# Altium project sign_controller.PrjPcb
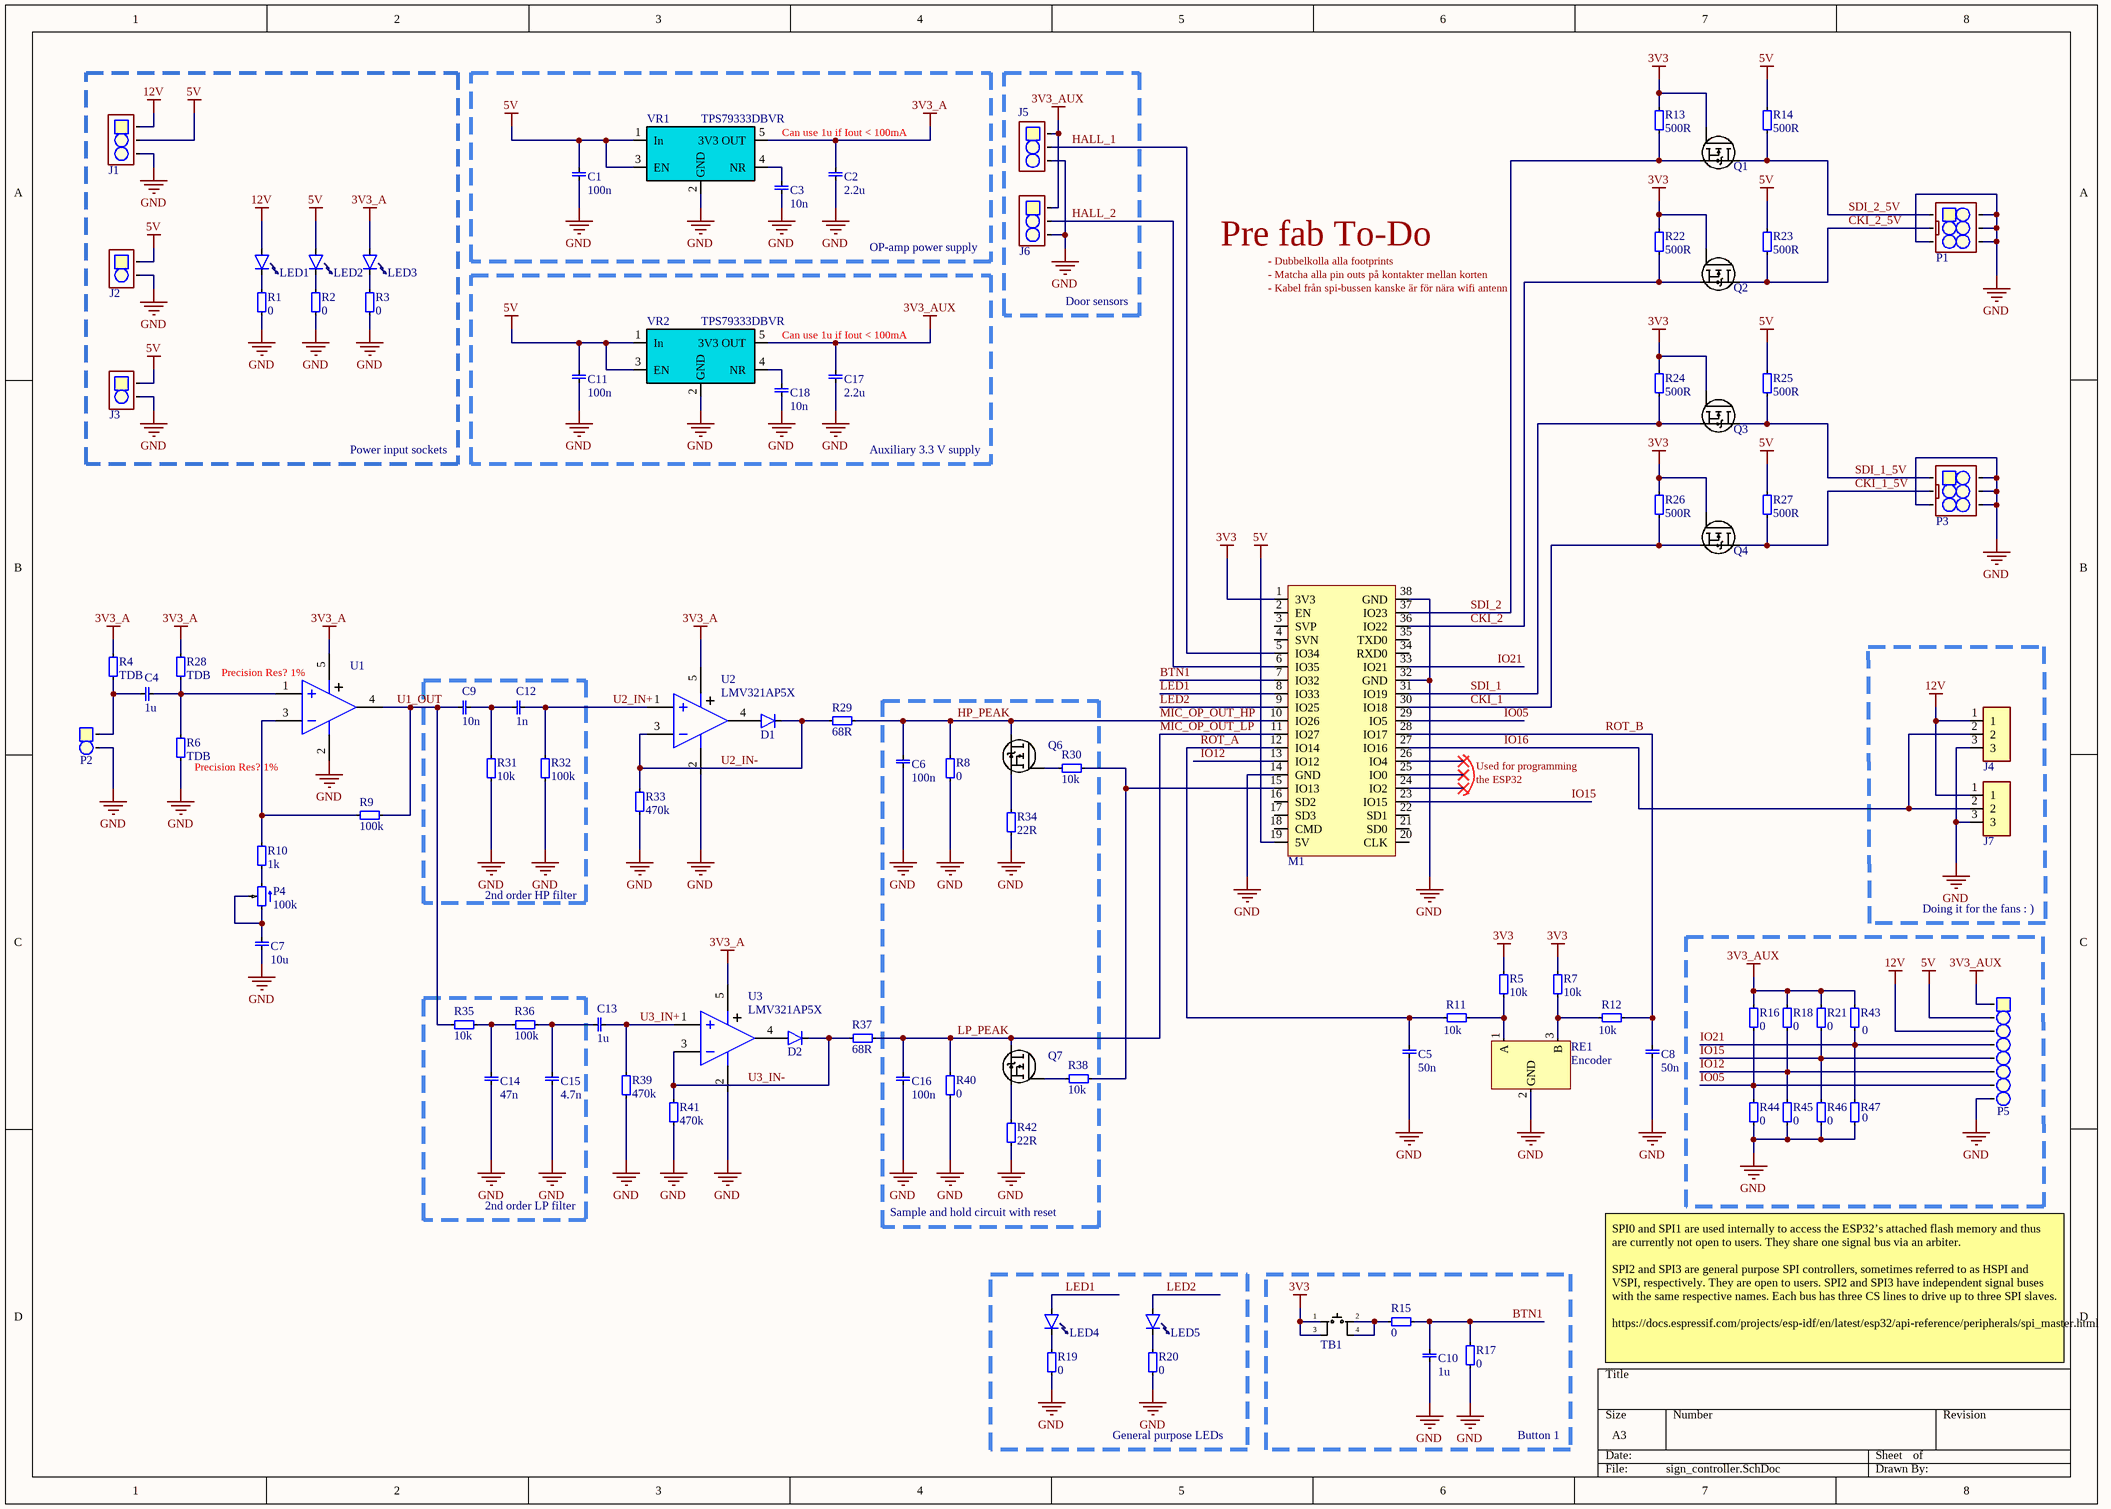
[diagram p0: sign_controller.SchDoc]
1 sheet, 98 parts. Net scope: global (net labels, ports and power ports of the same name join across sheets).
Board file: sign_controller.PcbDoc

## Sheet sign_controller.SchDoc
size A3; SheetNumber: 1; SheetTotal: 1

### Parts
C1  value 100n  [0603 cap]  (hidden comment: 0603, capacitor)
C2  value 2.2u  [1206, capasitor]  (hidden comment: 1206, capacitor)
C3  value 10n  [0603 cap]  (hidden comment: 0603, capacitor)
C4  value 1u  [1206, capasitor]  (hidden comment: 1206, capacitor)
C5  value 50n  [0603 cap]  (hidden comment: 0603, capacitor)
C6  value 100n  [0603 cap]  (hidden comment: 0603, capacitor)
C7  value 10u  [1206, capasitor]  (hidden comment: 1206, capacitor)
C8  value 50n  [0603 cap]  (hidden comment: 0603, capacitor)
C9  value 10n  [0603 cap]  (hidden comment: 0603, capacitor)
C10  value 1u  [0603 cap]  (hidden comment: 0603, capacitor)
C11  value 100n  [0603 cap]  (hidden comment: 0603, capacitor)
C12  value 1n  [0603 cap]  (hidden comment: 0603, capacitor)
C13  value 1u  [0603 cap]  (hidden comment: 0603, capacitor)
C14  value 47n  [0603 cap]  (hidden comment: 0603, capacitor)
C15  value 4.7n  [0603 cap]  (hidden comment: 0603, capacitor)
C16  value 100n  [0603 cap]  (hidden comment: 0603, capacitor)
C17  value 2.2u  [1206, capasitor]  (hidden comment: 1206, capacitor)
C18  value 10n  [0603 cap]  (hidden comment: 0603, capacitor)
D1  BAT18  [SOT23]  (value not drawn)
D2  BAT18  [SOT23]  (value not drawn)
J1  3 Pole MSTBA Connector  [3POLE_MSTBA_ANGLE]  (value not drawn)
J2  2 Pole MSTBA Connector  [2POLE_MSTBA_ANGLE]  (value not drawn)
J3  2 Pole MSTBA Connector  [2POLE_MSTBA_ANGLE]  (value not drawn)
J4  PicoBlade, 3 pos  [MOLEX_0530470310]  (value not drawn)
J5  3 Pole MSTBA Connector  [3POLE_MSTBA_ANGLE]  (value not drawn)
J6  3 Pole MSTBA Connector  [3POLE_MSTBA_ANGLE]  (value not drawn)
J7  PicoBlade, 3 pos  [MOLEX_0530470310]  (value not drawn)
LED1  0805, LED  [0805_led]  (value not drawn)
LED2  0805, LED  [0805_led]  (value not drawn)
LED3  0805, LED  [0805_led]  (value not drawn)
LED4  0805, LED  [0805_led]  (value not drawn)
LED5  0805, LED  [0805_led]  (value not drawn)
M1  ESP32-DEVKITC-32D-F  [ESP32_DEVKITC]  (value not drawn)
P1  2x3 Pin Header  [2x3 PH]  (value not drawn)
P2  1x2 Pin Header  [padtwo_L]  (value not drawn)
P3  2x3 Pin Header  [2x3 PH]  (value not drawn)
P4  value 100k  [POT_TH1]  (hidden comment: Pot)
P5  1x8 Pin Header  [1x8 Pin HEader]  (value not drawn)
Q1  BSS138  [SOT323]  (value not drawn)
Q2  BSS138  [SOT323]  (value not drawn)
Q3  BSS138  [SOT323]  (value not drawn)
Q4  BSS138  [SOT323]  (value not drawn)
Q6  BSS138  [SOT323]  (value not drawn)
Q7  BSS138  [SOT323]  (value not drawn)
R1  value 0  [0603]  (hidden comment: 0603, resistor)
R2  value 0  [0603]  (hidden comment: 0603, resistor)
R3  value 0  [0603]  (hidden comment: 0603, resistor)
R4  value TDB  [0603]  (hidden comment: 0603, resistor)
R5  value 10k  [0603]  (hidden comment: 0603, resistor)
R6  value TDB  [0603]  (hidden comment: 0603, resistor)
R7  value 10k  [0603]  (hidden comment: 0603, resistor)
R8  value 0  [0603]  (hidden comment: 0603, resistor)
R9  value 100k  [0603]  (hidden comment: 0603, resistor)
R10  value 1k  [0603]  (hidden comment: 0603, resistor)
R11  value 10k  [0603]  (hidden comment: 0603, resistor)
R12  value 10k  [0603]  (hidden comment: 0603, resistor)
R13  value 500R  [0603]  (hidden comment: 0603, resistor)
R14  value 500R  [0603]  (hidden comment: 0603, resistor)
R15  value 0  [0603]  (hidden comment: 0603, resistor)
R16  value 0  [0603]  (hidden comment: 0603, resistor)
R17  value 0  [0603]  (hidden comment: 0603, resistor)
R18  value 0  [0603]  (hidden comment: 0603, resistor)
R19  value 0  [0603]  (hidden comment: 0603, resistor)
R20  value 0  [0603]  (hidden comment: 0603, resistor)
R21  value 0  [0603]  (hidden comment: 0603, resistor)
R22  value 500R  [0603]  (hidden comment: 0603, resistor)
R23  value 500R  [0603]  (hidden comment: 0603, resistor)
R24  value 500R  [0603]  (hidden comment: 0603, resistor)
R25  value 500R  [0603]  (hidden comment: 0603, resistor)
R26  value 500R  [0603]  (hidden comment: 0603, resistor)
R27  value 500R  [0603]  (hidden comment: 0603, resistor)
R28  value TDB  [0603]  (hidden comment: 0603, resistor)
R29  value 68R  [0603]  (hidden comment: 0603, resistor)
R30  value 10k  [0603]  (hidden comment: 0603, resistor)
R31  value 10k  [0603]  (hidden comment: 0603, resistor)
R32  value 100k  [0603]  (hidden comment: 0603, resistor)
R33  value 470k  [0603]  (hidden comment: 0603, resistor)
R34  value 22R  [0603]  (hidden comment: 0603, resistor)
R35  value 10k  [0603]  (hidden comment: 0603, resistor)
R36  value 100k  [0603]  (hidden comment: 0603, resistor)
R37  value 68R  [0603]  (hidden comment: 0603, resistor)
R38  value 10k  [0603]  (hidden comment: 0603, resistor)
R39  value 470k  [0603]  (hidden comment: 0603, resistor)
R40  value 0  [0603]  (hidden comment: 0603, resistor)
R41  value 470k  [0603]  (hidden comment: 0603, resistor)
R42  value 22R  [0603]  (hidden comment: 0603, resistor)
R43  value 0  [0603]  (hidden comment: 0603, resistor)
R44  value 0  [0603]  (hidden comment: 0603, resistor)
R45  value 0  [0603]  (hidden comment: 0603, resistor)
R46  value 0  [0603]  (hidden comment: 0603, resistor)
R47  value 0  [0603]  (hidden comment: 0603, resistor)
RE1  Encoder  [RotaryEncoder]
TB1  Tactile Button  [tacButton smd]  (value not drawn)
U1  LMV321AP5X  [SOT23-5]  (value not drawn)
U2  LMV321AP5X  [SOT23-5]
U3  LMV321AP5X  [SOT23-5]
VR1  TPS79333DBVR  [SOT23-5]
VR2  TPS79333DBVR  [SOT23-5]

### Blocks framed on the sheet
Power input sockets: J1-J3 LED1-LED3 R1-R3
OP-amp power supply: C1-C3 VR1
Door sensors: J5 J6
Auxiliary 3.3 V supply: C11 C17 C18 VR2
Doing it for the fans : ): J4 J7
2nd order HP filter: C9 C12 R31 R32
Sample and hold circuit with reset: C6 C16 Q6 Q7 R8 R30 R34 R38 R40 R42
2nd order LP filter: C14 C15 R35 R36
Button 1: C10 R15 R17 TB1

### Nets
3V3: M1.1(3V3) Q1.1(G) Q2.1(G) Q3.1(G) Q4.1(G) R5.1 R7.1 R13.1 R22.1 R24.1 R26.1 TB1.1 TB1.3
3V3_A: C2.1 LED3.1 R4.0 R28.1 U1.5(V+) U2.5(V+) U3.5(V+) VR1.5(3V3_OUT)
3V3_AUX: C17.1 J5.1 J6.1 P5.1 R16.0 R18.0 R21.0 R43.0 VR2.5(3V3_OUT)
5V: C1.1 C11.1 J1.2 J2.1 J3.1 LED2.1 M1.19(5V) P5.2 R14.1 R23.1 R25.1 R27.1 VR1.1(In) VR1.3(EN) VR2.1(In) VR2.3(EN)
12V: J1.1 J4.1 J7.1 LED1.1 P5.3
GND: C1.0 C2.0 C3.0 C5.0 C6.0 C7.0 C8.0 C10.0 C11.0 C14.1 C15.1 C16.0 C17.0 C18.0 J1.3 J2.2 J3.2 J4.3 J5.3 J6.3 J7.3 M1.14(GND) M1.32(GND) M1.38(GND) P1.3 P1.4 P1.5 P1.6 P2.2 P3.3 P3.4 P3.5 P3.6 P5.8 R1.1 R2.1 R3.1 R6.1 R8.1 R17.1 R19.1 R20.1 R31.1 R32.1 R33.1 R34.1 R39.1 R40.1 R41.1 R42.1 R44.1 R45.1 R46.1 R47.1 RE1.2(GND) U1.2(V-) U2.2(V-) U3.2(V-) VR1.2(GND) VR2.2(GND)
BTN1: C10.1 M1.7(IO32) R15.0 R17.0
CKI_1: M1.30(IO18) Q4.2(S) R26.0
CKI_1_5V: P3.2 Q4.3(D) R27.0
CKI_2: M1.36(IO22) Q2.2(S) R22.0
CKI_2_5V: P1.2 Q2.3(D) R23.0
HALL_1: J5.2 M1.5(IO34)
HALL_2: J6.2 M1.6(IO35)
HP_PEAK: C6.1 M1.10(IO26) Q6.3(D) R8.0 R29.1  [also labelled MIC_OP_OUT_HP]
IO05: M1.29(IO5) P5.7 R16.1 R44.0
IO12: M1.13(IO12) P5.6 R18.1 R45.0
IO15: M1.23(IO15) P5.5 R21.1 R46.0
IO16: J4.2 J7.2 M1.27(IO16)
IO21: M1.33(IO21) P5.4 R43.1 R47.0
LED1: LED4.1 M1.8(IO33)
LED2: LED5.1 M1.9(IO25)
LP_PEAK: C16.1 M1.11(IO27) Q7.3(D) R37.1 R40.0  [also labelled MIC_OP_OUT_LP]
ROT_A: C5.1 M1.12(IO14) R11.0
ROT_B: C8.1 M1.28(IO17) R12.0
SDI_1: M1.31(IO19) Q3.2(S) R24.0
SDI_1_5V: P3.1 Q3.3(D) R25.0
SDI_2: M1.37(IO23) Q1.2(S) R13.0
SDI_2_5V: P1.1 Q1.3(D) R14.0
U1_OUT: C9.1 R9.1 R35.0 U1.4(OUT)
U2_IN+: C12.0 R32.0 U2.1(IN+)
U2_IN-: D1.3 R29.0 R33.0 U2.3(IN-)
U3_IN+: C13.0 R39.0 U3.1(IN+)
U3_IN-: D2.3 R37.0 R41.0 U3.3(IN-)
NetC3_1: C3.1 VR1.4(NR)
NetC4_0: C4.0 R6.0 R28.0 U1.1(IN+)
NetC4_1: C4.1 P2.1 R4.1
NetC7_1: C7.1 P4.1 P4.2
NetC9_0: C9.0 C12.1 R31.0
NetC13_1: C13.1 C15.0 R36.1
NetC14_0: C14.0 R35.1 R36.0
NetC18_1: C18.1 VR2.4(NR)
NetD1_1: D1.1 U2.4(OUT)
NetD2_1: D2.1 U3.4(OUT)
NetLED1_0: LED1.0(Cathode) R1.0
NetLED2_0: LED2.0(Cathode) R2.0
NetLED3_0: LED3.0(Cathode) R3.0
NetLED4_0: LED4.0(Cathode) R19.0
NetLED5_0: LED5.0(Cathode) R20.0
NetM1_15: M1.15(IO13) R30.1 R38.1
NetP4_3: P4.3 R10.1
NetQ6_1: Q6.1(G) R30.0
NetQ6_2: Q6.2(S) R34.0
NetQ7_1: Q7.1(G) R38.0
NetQ7_2: Q7.2(S) R42.0
NetR5_0: R5.0 R11.1 RE1.1(A)
NetR7_0: R7.0 R12.1 RE1.3(B)
NetR9_0: R9.0 R10.0 U1.3(IN-)
NetR15_1: R15.1 TB1.2 TB1.4

Not connected (* = marked no-connect by the designer): M1 2(EN) 3(SVP) 4(SVN) 16(SD2) 17(SD3) 18(CMD) 20(CLK) 21(SD0) 22(SD1) 24(IO2)* 25(IO0)* 26(IO4)* 34(RXD0) 35(TXD0)

### Notes on the sheet
- Can use 1u if Iout < 100mA
- Pre fab To-Do
- - Dubbelkolla alla footprints
- - Matcha alla pin outs på kontakter mellan korten
- - Kabel från spi-bussen kanske är för nära wifi antenn
- (near U1) Precision Res? 1%
- (near R6) Precision Res? 1%
- Used for programming
- the ESP32
- (near R37) Limit OP amp and diode current
- Resistor prevents saturation due to leak currents
- (near R41) Needed to let current through the diode
- SPI0 and SPI1 are used internally to access the ESP32’s attached flash memory and thus are currently not open to users. They share one signal bus via an arbiter.
  SPI2 and SPI3 are general purpose SPI controllers, sometimes referred to as HSPI and VSPI, respectively. They are open to users. SPI2 and SPI3 have independent signal buses with the same respective names. Each bus has three CS lines to drive up to three SPI slaves.
  https://docs.espressif.com/projects/esp-idf/en/latest/esp32/api-reference/peripherals/spi_master.html
- General purpose LEDs

### Library data of the parts
D1 D2 = Diode SMD: Electrokit art: 40311018, 100mA, Vf 1.2V, 35V
J4 J7 = PicoBlade, 3 pos: Class: B; Manufacturer: *; Manufacturer part number: *; Mount: Yes
LED1-LED5 = 0805, LED: Value: 0805 LED
P1 P3 = 2x3 Ribbon connector: Value: 2x3 Pin Header, 2.54mm
P2 = 1x2 Pin Header: 2.54 mm, TH; Value: 1x2 Pin Header
P5 = 1x8 Pin Header: 2.54 mm; Value: 1x8 Pin Header
Q1-Q4 Q6 Q7 = BSS138: N-Channel Logic Level Enhancement Mode Field Effect Transistor
RE1 = RotaryEncoder
TB1 = TacButton SMD: Tactile Switch Small Low; ELFA: 110-87-406; Value: Button SMD
U1-U3 = LMV321AP5X: Operational Amplifier, Low Power, Rail to Rail Output, CMOS Op-Amp; Manufacturer: ON Semiconductor / Fairchild; Operating Supply Voltage: 5.5V; Voltage Gain: 70dB; Min Dual Supply Voltage: 1.35V; Max Dual Supply Voltage: 2.75V; Common Mode Rejection Ratio: 50dB; Number of Channels: 1; Output Current: 34mA; Slew Rate: 1.5V/µs; Nominal Supply Current: 80uA; Input Offset Voltage (Vos): 7mV; Input Bias Current: 1nA; Gain Bandwidth Product: 1.4MHz; Min Supply Voltage: 2.7V; Operating Supply Current: 100uA; Supplier 1: Mouser; Manufacturer Part Number: LMV321AP5X; RoHS: Yes; Category: Amplifiers - Op Amps, Buffer, Instrumentation; Pricing 1: 1=0,51000, 10=0,43100, 50=0,43100, 100=0,29900, 500=0,25300, 1000=0,19600, 3000=0,17700, 9000=0,16700, 10000=0,16700 (USD); Mount: Surface Mount; Case/Package: SC; Number of Pins: 5; Weight: 23g; Min Operating Temperature: -40°C; Max Operating Temperature: 125°C; Packaging: Tape and Reel; Max Supply Voltage: 5.5V; Package Quantity: 1; Bandwidth: 1.4MHz; Unity Gain Bandwidth Product: 1.4MHz; Number of Circuits: 1; Output Current per Channel: 34mA; Number of Elements: 1; Power Supply Rejection Ratio (PSRR): 50dB; Number of Amplifiers: 1; Length: 2.2mm; Width: 1.35mm; Height: 1mm; Radiation Hardening: No; REACH SVHC: No SVHC; Lead Free: Lead Free; RoHS Compliant: Yes; ComponentLink1URL: https://datasheet.ciiva.com/25629/0900766b810c08e0-25629312.pdf?src-supplier=RSComponents; ComponentLink1Description: https://datasheet.ciiva.com/25629/0900766b810c08e0-25629312.pdf?src-supplier=RSComponents; ComponentLink2URL: https://datasheet.ciiva.com/17359/lmv321-17359885.pdf?src-supplier=Future+Electronics; ComponentLink2Description: https://datasheet.ciiva.com/17359/lmv321-17359885.pdf?src-supplier=Future+Electronics; ComponentLink3URL: https://datasheet.ciiva.com/26243/lmv358-26243564.pdf?src-supplier=Avnet+Europe; ComponentLink3Description: https://datasheet.ciiva.com/26243/lmv358-26243564.pdf?src-supplier=Avnet+Europe; ComponentLink4URL: https://datasheet.ciiva.com/1792/lmv321-1792987.pdf?src-supplier=Digi-Key; ComponentLink4Description: https://datasheet.ciiva.com/1792/lmv321-1792987.pdf?src-supplier=Digi-Key; ComponentLink5URL: https://datasheet.ciiva.com/1792/lmv321-1792988.pdf?src-supplier=Digi-Key; ComponentLink5Description: https://datasheet.ciiva.com/1792/lmv321-1792988.pdf?src-supplier=Digi-Key; ComponentLink6URL: https://datasheet.ciiva.com/1792/lmv321-1792986.pdf?src-supplier=Digi-Key; ComponentLink6Description: https://datasheet.ciiva.com/1792/lmv321-1792986.pdf?src-supplier=Digi-Key; Supplier Part Number 1: 512-LMV321AP5X
VR1 VR2 = TPS79333DBVR: Low Dropout Regulators(LDO) Positive Fixed 180mV @ 200mA 5.5V 3.3V 200mA SOT-23-5 RoHS; Manufacturer: Texas Instruments; Number of Outputs: 1; Dropout Voltage: 102mV; Max Power Dissipation: 560mW; Min Input Voltage: 2.7V; Min Current Limit: 285mA; Input Bias Current: 170uA; Quiescent Current: 200uA; Output Voltage Accuracy: 2%; Supplier 1: Mouser; Manufacturer Part Number: TPS79333DBVR; RoHS: Yes; Category: Voltage Regulators - Linear; Pricing 1: 1=0,94000, 10=0,81900, 50=0,81900, 100=0,62800, 250=0,58300, 500=0,49700, 1000=0,39700, 3000=0,36000, 10000=0,36000 (USD); Case/Package: SOT-23; Number of Pins: 5; Min Operating Temperature: -40°C; Max Operating Temperature: 125°C; Output Voltage: 3.3V; Output Current: 200mA; Packaging: Tape and Reel; Package Quantity: 1; Max Output Current: 200mA; Max Input Voltage: 5.5V; Number of Regulators: 1; Min Output Voltage: 3.3V; Polarity: Positive; Power Dissipation: 560mW; Max Output Voltage: 3.3V; Accuracy: 2%; Output Type: Fixed; Nominal Output Voltage: 3.3V; Power Rating: 560mW; Max Supply Voltage: 5.5V; Min Supply Voltage: 2.7V; Termination: SMD/SMT; Current Rating: 200mA; Length: 2.9mm; Width: 1.6mm; Height: 1.15mm; Radiation Hardening: No; Lead Free: Lead Free; RoHS Compliant: Yes; REACH SVHC: No SVHC; ComponentLink1URL: https://datasheet.ciiva.com/34302/1123416-34302001.pdf?src-supplier=Jameco; ComponentLink1Description: https://datasheet.ciiva.com/34302/1123416-34302001.pdf?src-supplier=Jameco; ComponentLink2URL: https://datasheet.ciiva.com/22734/1828169-22734577.pdf?src-supplier=Farnell; ComponentLink2Description: https://datasheet.ciiva.com/22734/1828169-22734577.pdf?src-supplier=Farnell; Supplier Part Number 1: 595-TPS79333DBVR
C1 C3 C5 C6 C8-C16 C18 = 0603, capacitor: Order number: *